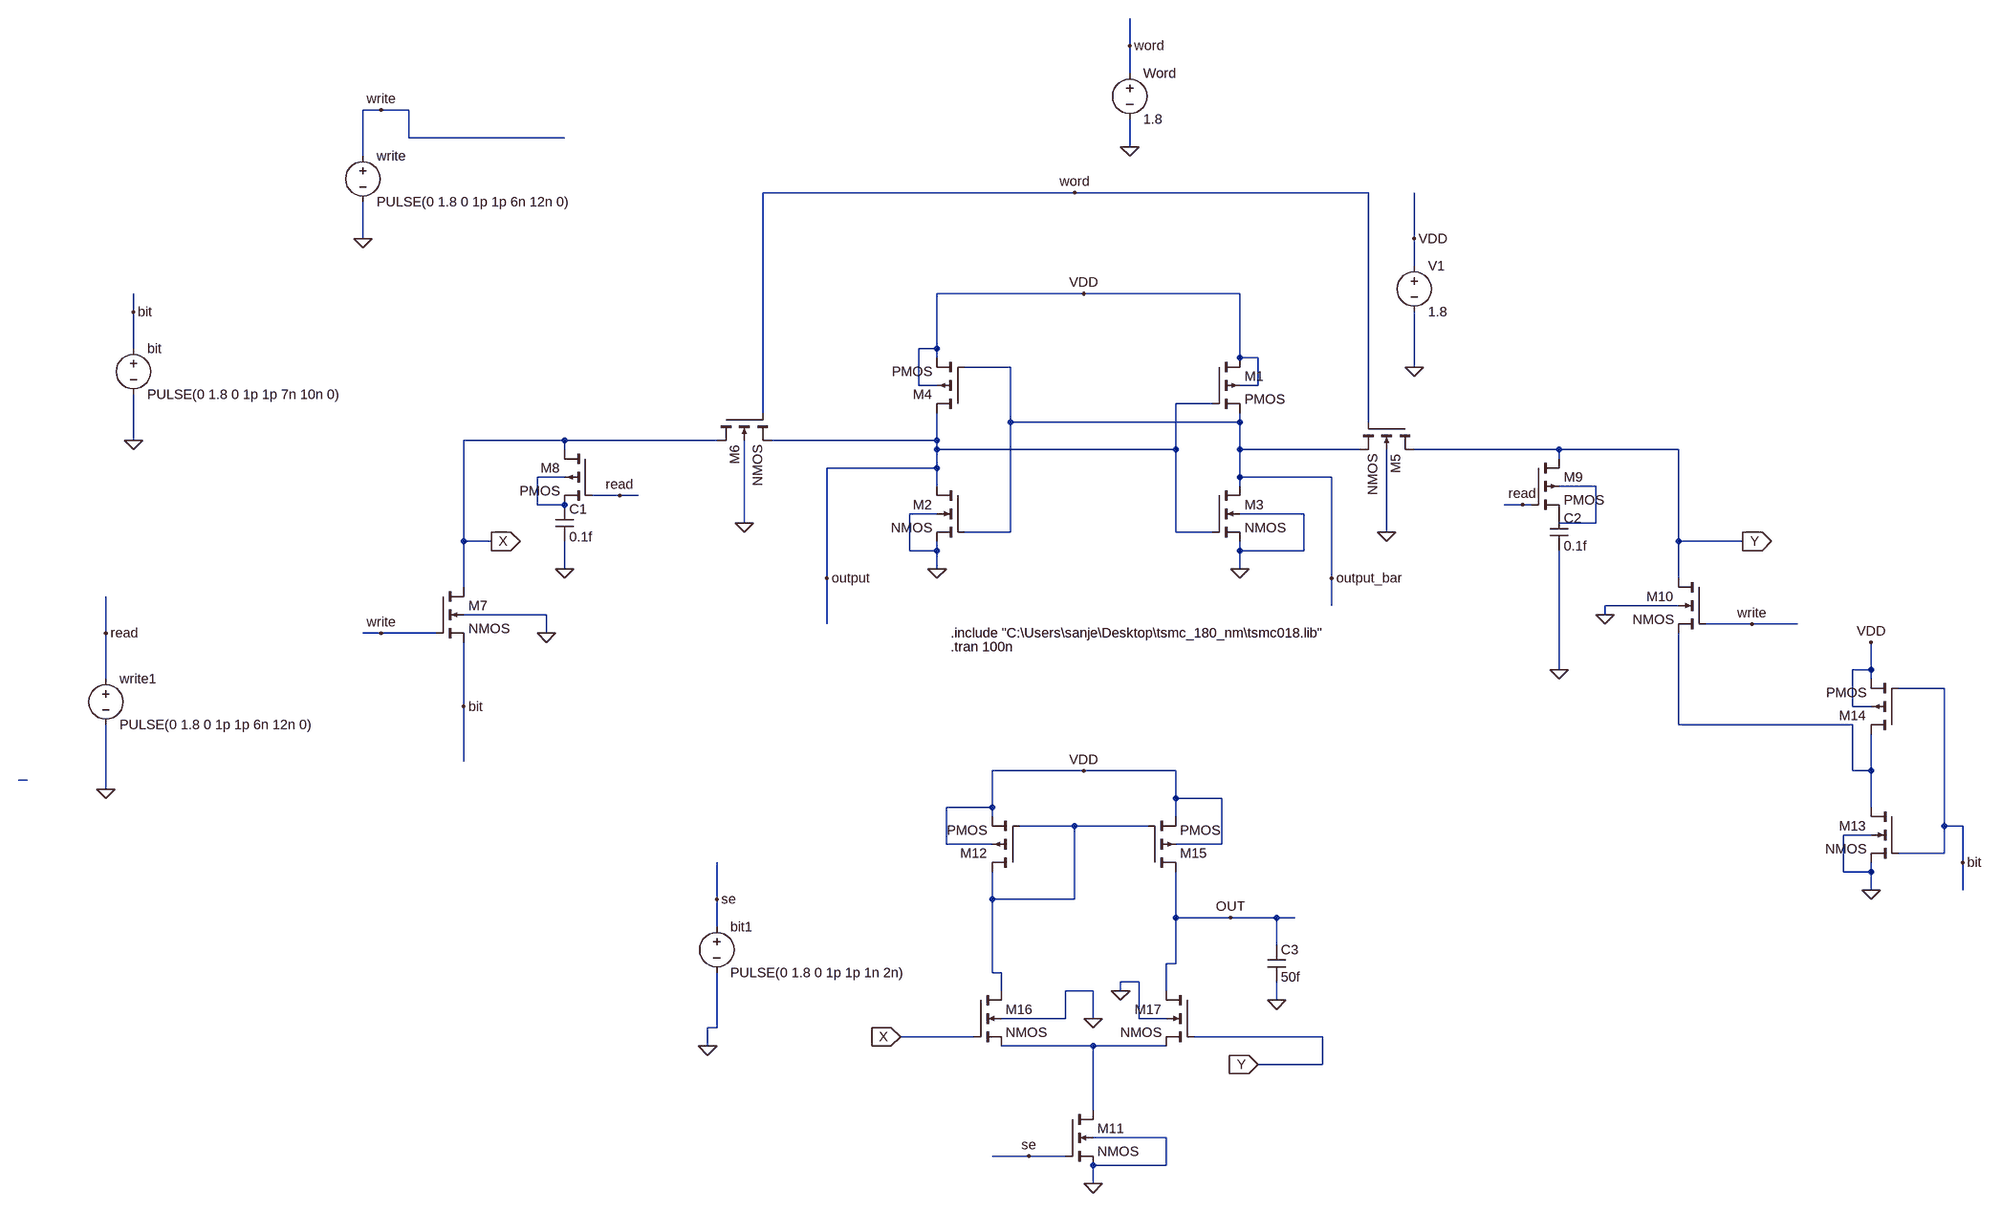
[diagram p0: schematic 6T -SRAM_read.asc]
6T -SRAM_read.asc, the LTspice schematic file:
Version 4.1
SHEET 1 2032 1252
WIRE 144 -752 144 -800
WIRE 144 -704 144 -752
WIRE -1168 -640 -1200 -640
WIRE -1120 -640 -1168 -640
WIRE -1120 -592 -1120 -640
WIRE -848 -592 -1120 -592
WIRE 144 -576 144 -624
WIRE -1200 -560 -1200 -640
WIRE 48 -496 -496 -496
WIRE 560 -496 48 -496
WIRE -1200 -416 -1200 -480
WIRE 640 -416 640 -496
WIRE 640 -368 640 -416
WIRE 64 -320 -192 -320
WIRE 336 -320 64 -320
WIRE -1600 -288 -1600 -320
WIRE -1600 -224 -1600 -288
WIRE -192 -224 -192 -320
WIRE -192 -224 -224 -224
WIRE -192 -208 -192 -224
WIRE 336 -208 336 -320
WIRE 368 -208 336 -208
WIRE -64 -192 -144 -192
WIRE 640 -192 640 -288
WIRE -224 -160 -224 -224
WIRE -192 -160 -224 -160
WIRE 368 -160 368 -208
WIRE 368 -160 336 -160
WIRE 288 -128 224 -128
WIRE -496 -112 -496 -496
WIRE -64 -96 -64 -192
WIRE 336 -96 336 -112
WIRE 336 -96 -64 -96
WIRE 560 -96 560 -496
WIRE -1600 -64 -1600 -144
WIRE -848 -64 -1024 -64
WIRE -576 -64 -848 -64
WIRE -192 -64 -192 -112
WIRE -192 -64 -480 -64
WIRE -848 -48 -848 -64
WIRE -192 -48 -192 -64
WIRE 224 -48 224 -128
WIRE 224 -48 -192 -48
WIRE 336 -48 336 -96
WIRE 544 -48 336 -48
WIRE 896 -48 640 -48
WIRE 1104 -48 896 -48
WIRE 896 -32 896 -48
WIRE -192 -16 -192 -48
WIRE -192 -16 -384 -16
WIRE -848 0 -896 0
WIRE 336 0 336 -48
WIRE 496 0 336 0
WIRE -192 16 -192 -16
WIRE 336 16 336 0
WIRE 960 16 896 16
WIRE -752 32 -800 32
WIRE -720 32 -752 32
WIRE -896 48 -896 0
WIRE -848 48 -896 48
WIRE 832 48 800 48
WIRE 848 48 832 48
WIRE -192 64 -240 64
WIRE 448 64 336 64
WIRE -528 80 -528 -64
WIRE 960 80 960 16
WIRE 960 80 896 80
WIRE -64 96 -64 -96
WIRE -64 96 -144 96
WIRE 224 96 224 -48
WIRE 288 96 224 96
WIRE 592 96 592 -48
WIRE -1024 112 -1024 -64
WIRE -976 112 -1024 112
WIRE 1104 112 1104 -48
WIRE 1216 112 1104 112
WIRE -240 128 -240 64
WIRE -192 128 -192 112
WIRE -192 128 -240 128
WIRE 336 128 336 112
WIRE 448 128 448 64
WIRE 448 128 336 128
WIRE -848 160 -848 112
WIRE -192 160 -192 128
WIRE 336 160 336 128
WIRE -384 176 -384 -16
WIRE 496 176 496 0
WIRE 1104 176 1104 112
WIRE -1024 192 -1024 112
WIRE 496 224 496 176
WIRE 1104 224 976 224
WIRE -880 240 -1024 240
WIRE 976 240 976 224
WIRE -384 256 -384 176
WIRE 1232 256 1152 256
WIRE 1312 256 1232 256
WIRE -1648 272 -1648 208
WIRE -1168 272 -1200 272
WIRE -1072 272 -1168 272
WIRE -880 272 -880 240
WIRE 896 336 896 128
WIRE 1440 336 1440 288
WIRE 1440 336 1408 336
WIRE -1648 352 -1648 272
WIRE 1440 352 1440 336
WIRE 1568 368 1488 368
WIRE -1024 400 -1024 288
WIRE 1408 400 1408 336
WIRE 1440 400 1408 400
WIRE 1104 432 1104 272
WIRE 1408 432 1104 432
WIRE -1024 496 -1024 400
WIRE 64 512 -96 512
WIRE 224 512 64 512
WIRE 1408 512 1408 432
WIRE 1440 512 1440 448
WIRE 1440 512 1408 512
WIRE -1968 528 -1984 528
WIRE -1648 544 -1648 432
WIRE 224 560 224 512
WIRE 304 560 224 560
WIRE -96 576 -96 512
WIRE -96 576 -176 576
WIRE 1440 576 1440 512
WIRE -96 592 -96 576
WIRE 224 592 224 560
WIRE 48 608 -48 608
WIRE 176 608 48 608
WIRE 1568 608 1568 368
WIRE 1600 608 1568 608
WIRE 1440 624 1392 624
WIRE -176 640 -176 576
WIRE -96 640 -176 640
WIRE 304 640 304 560
WIRE 304 640 224 640
WIRE 1568 656 1568 608
WIRE 1568 656 1488 656
WIRE 1600 672 1600 608
WIRE 1392 688 1392 624
WIRE 1440 688 1440 672
WIRE 1440 688 1392 688
WIRE 1440 720 1440 688
WIRE 1600 720 1600 672
WIRE -576 736 -576 672
WIRE -96 736 -96 688
WIRE 48 736 48 608
WIRE 48 736 -96 736
WIRE 224 768 224 688
WIRE 320 768 224 768
WIRE 400 768 320 768
WIRE 432 768 400 768
WIRE -576 784 -576 736
WIRE 400 816 400 768
WIRE 224 848 224 768
WIRE 224 848 208 848
WIRE -96 864 -96 736
WIRE -80 864 -96 864
WIRE 160 880 128 880
WIRE -80 896 -80 864
WIRE 80 896 32 896
WIRE 128 896 128 880
WIRE 208 896 208 848
WIRE 400 912 400 880
WIRE 32 944 32 896
WIRE 32 944 -80 944
WIRE 80 944 80 896
WIRE 160 944 160 880
WIRE 208 944 160 944
WIRE -576 960 -576 864
WIRE -576 960 -592 960
WIRE -128 976 -256 976
WIRE 480 976 256 976
WIRE -592 992 -592 960
WIRE 80 992 -80 992
WIRE 208 992 80 992
WIRE 480 1024 480 976
WIRE 480 1024 368 1024
WIRE 80 1104 80 992
WIRE 208 1152 80 1152
WIRE -32 1184 -96 1184
WIRE 32 1184 -32 1184
WIRE 208 1200 208 1152
WIRE 208 1200 80 1200
WIRE 80 1232 80 1200
FLAG 336 160 0
FLAG -192 160 0
FLAG 64 -320 VDD
FLAG 640 -192 0
FLAG 640 -416 VDD
FLAG 48 -496 word
FLAG 144 -576 0
FLAG 144 -752 word
FLAG -528 80 0
FLAG 592 96 0
FLAG -1200 -416 0
FLAG 976 240 0
FLAG -384 176 output
FLAG 496 176 output_bar
FLAG 1440 720 0
FLAG 1440 288 VDD
FLAG -1168 -640 write
FLAG -1600 -64 0
FLAG 1600 672 bit
FLAG 1232 256 write
FLAG -880 272 0
FLAG -1024 400 bit
FLAG -1168 272 write
FLAG 64 512 VDD
FLAG 80 944 0
FLAG 80 1232 0
FLAG -32 1184 se
FLAG -592 992 0
FLAG -576 736 se
FLAG 128 896 0
FLAG 320 768 OUT
FLAG -1600 -288 bit
FLAG -848 160 0
FLAG 896 336 0
FLAG 400 912 0
FLAG -976 112 X
IOPIN -976 112 Out
FLAG 1216 112 Y
IOPIN 1216 112 Out
FLAG -256 976 X
IOPIN -256 976 In
FLAG 368 1024 Y
IOPIN 368 1024 In
FLAG -1648 544 0
FLAG -1648 272 read
FLAG -752 32 read
FLAG 832 48 read
SYMBOL pmos4 288 -208 R0
SYMATTR InstName M1
SYMATTR Value2 l=0.18u w=0.2u
SYMBOL nmos4 288 16 R0
SYMATTR InstName M3
SYMATTR Value2 l=0.18u w=0.1u
SYMBOL nmos4 -144 16 M0
SYMATTR InstName M2
SYMATTR Value2 l=0.18u w=0.1u
SYMBOL pmos4 -144 -112 R180
SYMATTR InstName M4
SYMATTR Value2 l=0.18u w=0.2u
SYMBOL voltage 640 -384 R0
WINDOW 123 0 0 Left 0
WINDOW 39 0 0 Left 0
SYMATTR InstName V1
SYMATTR Value 1.8
SYMBOL nmos4 640 -96 R90
SYMATTR InstName M5
SYMATTR Value2 l=0.18u w=0.1u
SYMBOL nmos4 -576 -112 M90
SYMATTR InstName M6
SYMATTR Value2 l=0.18u w=0.6u
SYMBOL voltage 144 -720 R0
WINDOW 123 0 0 Left 0
WINDOW 39 0 0 Left 0
SYMATTR InstName Word
SYMATTR Value 1.8
SYMBOL voltage -1200 -576 R0
WINDOW 123 0 0 Left 0
WINDOW 39 0 0 Left 0
SYMATTR InstName write
SYMATTR Value PULSE(0 1.8 0 1p 1p 6n 12n 0)
SYMBOL nmos4 1488 576 M0
SYMATTR InstName M13
SYMATTR Value2 l=0.18u w=0.5u
SYMBOL pmos4 1488 448 R180
SYMATTR InstName M14
SYMATTR Value2 l=0.15u w=1u
SYMBOL voltage -1600 -240 R0
WINDOW 123 0 0 Left 0
WINDOW 39 0 0 Left 0
SYMATTR InstName bit
SYMATTR Value PULSE(0 1.8 0 1p 1p 7n 10n 0)
SYMBOL nmos4 -1072 192 R0
SYMATTR InstName M7
SYMATTR Value2 l=0.18u w=0.1u
SYMBOL nmos4 1152 176 M0
SYMATTR InstName M10
SYMATTR Value2 l=0.18u w=0.2u
SYMBOL nmos4 32 1104 R0
SYMATTR InstName M11
SYMATTR Value2 l=0.18u w=3u
SYMBOL pmos4 -48 688 R180
SYMATTR InstName M12
SYMATTR Value2 l=0.18u w=4u
SYMBOL pmos4 176 688 M180
SYMATTR InstName M15
SYMATTR Value2 l=0.18u w=4u
SYMBOL nmos4 -128 896 R0
SYMATTR InstName M16
SYMATTR Value2 l=0.18u w=6u
SYMBOL nmos4 256 896 M0
SYMATTR InstName M17
SYMATTR Value2 l=0.18u w=6u
SYMBOL voltage -576 768 R0
WINDOW 123 0 0 Left 0
WINDOW 39 0 0 Left 0
SYMATTR InstName bit1
SYMATTR Value PULSE(0 1.8 0 1p 1p 1n 2n)
SYMBOL pmos4 -800 -48 M0
SYMATTR InstName M8
SYMATTR Value2 l=0.18u w=0.2u
SYMBOL pmos4 848 -32 R0
SYMATTR InstName M9
SYMATTR Value2 l=0.18u w=0.2u
SYMBOL cap -864 48 R0
SYMATTR InstName C1
SYMATTR Value 0.1f
SYMBOL cap 880 64 R0
SYMATTR InstName C2
SYMATTR Value 0.1f
SYMBOL cap 384 816 R0
SYMATTR InstName C3
SYMATTR Value 50f
SYMBOL voltage -1648 336 R0
WINDOW 123 0 0 Left 0
WINDOW 39 0 0 Left 0
SYMATTR InstName write1
SYMATTR Value PULSE(0 1.8 0 1p 1p 6n 12n 0)
TEXT -168 272 Left 2 !.include "C:\\Users\\sanje\\Desktop\\tsmc_180_nm\\tsmc018.lib"
TEXT -168 296 Left 2 !.tran 100n

The netlist it stands for:
* 6T -SRAM_read.asc
M1 VDD output output_bar VDD PMOS l=0.18u w=0.2u
M3 output_bar output 0 0 NMOS l=0.18u w=0.1u
M2 output output_bar 0 0 NMOS l=0.18u w=0.1u
M4 output output_bar VDD VDD PMOS l=0.18u w=0.2u
V1 VDD 0 1.8
M5 Y word output_bar 0 NMOS l=0.18u w=0.1u
M6 X word output 0 NMOS l=0.18u w=0.6u
V§Word word 0 1.8
V§write write 0 PULSE(0 1.8 0 1p 1p 6n 12n 0)
M13 N003 bit 0 0 NMOS l=0.18u w=0.5u
M14 N003 bit VDD VDD PMOS l=0.15u w=1u
V§bit bit 0 PULSE(0 1.8 0 1p 1p 7n 10n 0)
M7 X write bit 0 NMOS l=0.18u w=0.1u
M10 Y write N003 0 NMOS l=0.18u w=0.2u
M11 N006 se 0 0 NMOS l=0.18u w=3u
M12 N005 N005 VDD VDD PMOS l=0.18u w=4u
M15 OUT N005 VDD VDD PMOS l=0.18u w=4u
M16 N005 X N006 0 NMOS l=0.18u w=6u
M17 OUT Y N006 0 NMOS l=0.18u w=6u
V§bit1 se 0 PULSE(0 1.8 0 1p 1p 1n 2n)
M8 X read N001 N001 PMOS l=0.18u w=0.2u
M9 Y read P001 N002 PMOS l=0.18u w=0.2u
C1 N001 0 0.1f
C2 P001 0 0.1f
C3 OUT 0 50f
V§write1 read 0 PULSE(0 1.8 0 1p 1p 6n 12n 0)
.model NMOS NMOS
.model PMOS PMOS
.lib standard.mos
.include "C:\Users\sanje\Desktop\tsmc_180_nm\tsmc018.lib"
.tran 100n
.backanno
.end